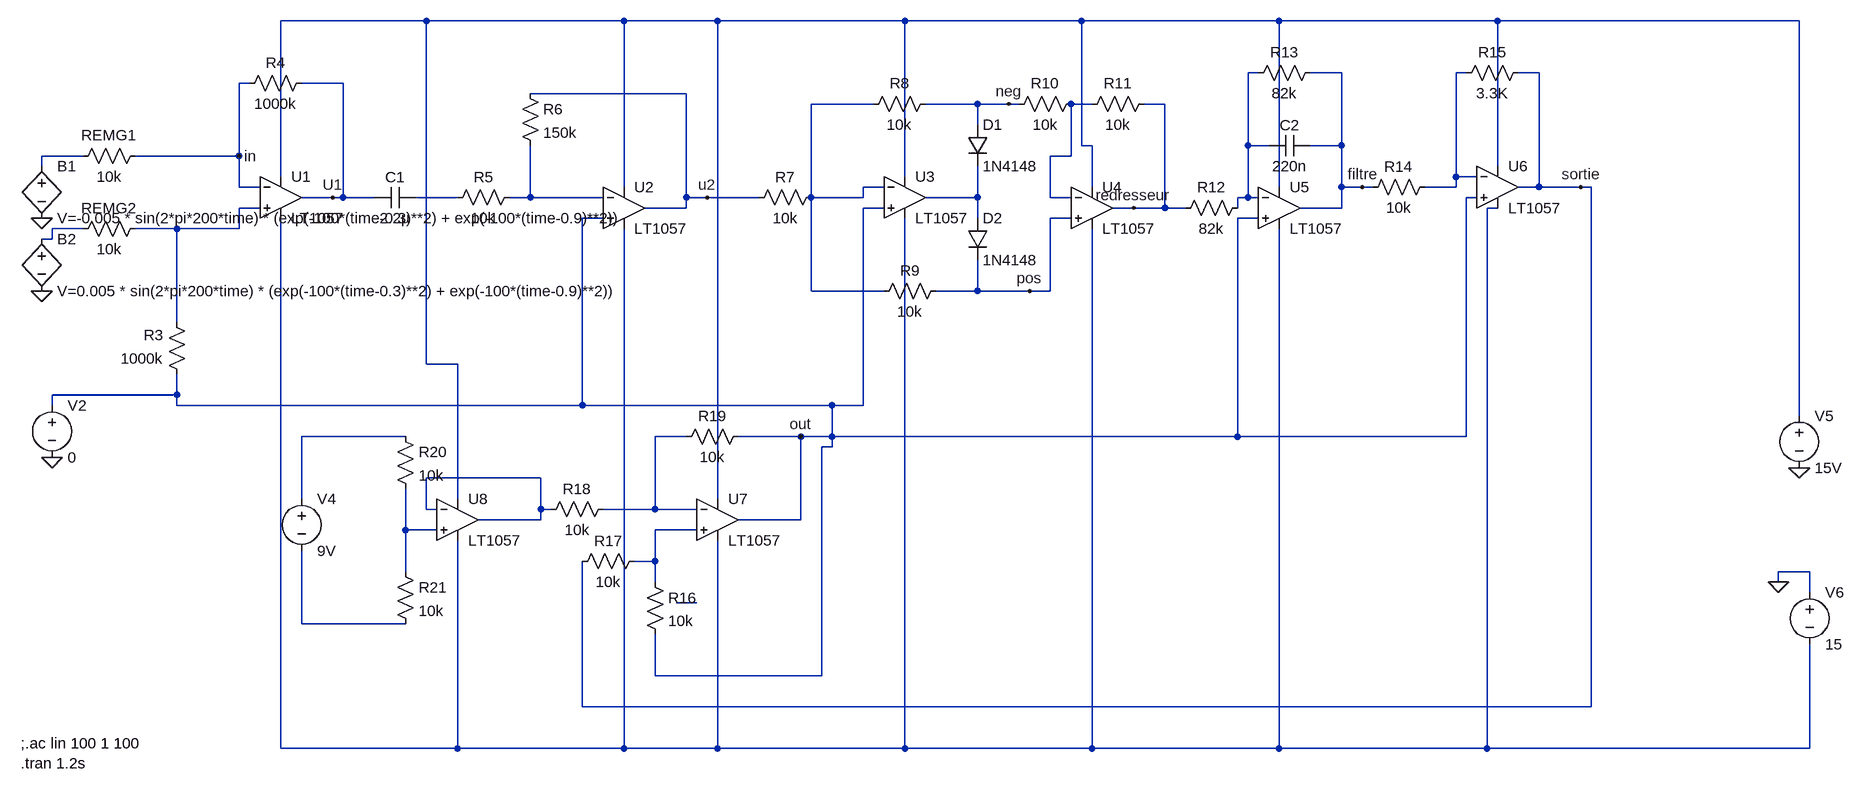
[diagram p0: schematic diagram_modified2.asc]
diagram_modified2.asc, the LTspice schematic file:
Version 4.1
SHEET 1 2724 680
WIRE 496 -1648 272 -1648
WIRE 800 -1648 496 -1648
WIRE 944 -1648 800 -1648
WIRE 1232 -1648 944 -1648
WIRE 1504 -1648 1232 -1648
WIRE 1808 -1648 1504 -1648
WIRE 2144 -1648 1808 -1648
WIRE 2608 -1648 2144 -1648
WIRE 1776 -1568 1760 -1568
WIRE 1904 -1568 1856 -1568
WIRE 2096 -1568 2080 -1568
WIRE 2208 -1568 2176 -1568
WIRE 224 -1552 208 -1552
WIRE 368 -1552 304 -1552
WIRE 896 -1536 656 -1536
WIRE 1184 -1520 1088 -1520
WIRE 1344 -1520 1264 -1520
WIRE 1392 -1520 1344 -1520
WIRE 1408 -1520 1392 -1520
WIRE 1520 -1520 1488 -1520
WIRE 1632 -1520 1600 -1520
WIRE 1344 -1488 1344 -1520
WIRE 1504 -1456 1504 -1648
WIRE 1520 -1456 1504 -1456
WIRE 1760 -1456 1760 -1568
WIRE 1792 -1456 1760 -1456
WIRE 1904 -1456 1904 -1568
WIRE 1904 -1456 1856 -1456
WIRE -32 -1440 -96 -1440
WIRE 208 -1440 208 -1552
WIRE 208 -1440 48 -1440
WIRE 1488 -1440 1488 -1520
WIRE 1488 -1440 1456 -1440
WIRE -96 -1424 -96 -1440
WIRE 2144 -1424 2144 -1648
WIRE 272 -1408 272 -1648
WIRE 1232 -1408 1232 -1648
WIRE 2080 -1408 2080 -1568
WIRE 2112 -1408 2080 -1408
WIRE 208 -1392 208 -1440
WIRE 240 -1392 208 -1392
WIRE 800 -1392 800 -1648
WIRE 1200 -1392 1168 -1392
WIRE 1520 -1392 1520 -1456
WIRE 1808 -1392 1808 -1648
WIRE 1904 -1392 1904 -1456
WIRE 1936 -1392 1904 -1392
WIRE 1952 -1392 1936 -1392
WIRE 2080 -1392 2080 -1408
WIRE 2080 -1392 2032 -1392
WIRE 2208 -1392 2208 -1568
WIRE 2208 -1392 2176 -1392
WIRE 2272 -1392 2208 -1392
WIRE 2288 -1392 2272 -1392
WIRE 352 -1376 304 -1376
WIRE 368 -1376 368 -1552
WIRE 368 -1376 352 -1376
WIRE 416 -1376 368 -1376
WIRE 544 -1376 480 -1376
WIRE 656 -1376 656 -1456
WIRE 656 -1376 624 -1376
WIRE 768 -1376 656 -1376
WIRE 896 -1376 896 -1536
WIRE 928 -1376 896 -1376
WIRE 1008 -1376 928 -1376
WIRE 1088 -1376 1088 -1520
WIRE 1168 -1376 1168 -1392
WIRE 1168 -1376 1088 -1376
WIRE 1344 -1376 1344 -1424
WIRE 1344 -1376 1264 -1376
WIRE 1456 -1376 1456 -1440
WIRE 1488 -1376 1456 -1376
WIRE 1760 -1376 1760 -1456
WIRE 1760 -1376 1744 -1376
WIRE 1776 -1376 1760 -1376
WIRE 2112 -1376 2096 -1376
WIRE 240 -1360 208 -1360
WIRE 896 -1360 896 -1376
WIRE 896 -1360 832 -1360
WIRE 1200 -1360 1168 -1360
WIRE 1584 -1360 1552 -1360
WIRE 1632 -1360 1632 -1520
WIRE 1632 -1360 1584 -1360
WIRE 1664 -1360 1632 -1360
WIRE 1744 -1360 1744 -1376
WIRE 1904 -1360 1904 -1392
WIRE 1904 -1360 1840 -1360
WIRE 2144 -1360 2128 -1360
WIRE 768 -1344 736 -1344
WIRE 1344 -1344 1344 -1376
WIRE 1488 -1344 1456 -1344
WIRE 1776 -1344 1744 -1344
WIRE -32 -1328 -80 -1328
WIRE 112 -1328 48 -1328
WIRE 208 -1328 208 -1360
WIRE 208 -1328 112 -1328
WIRE -80 -1312 -80 -1328
WIRE -80 -1312 -96 -1312
WIRE 1088 -1232 1088 -1376
WIRE 1200 -1232 1088 -1232
WIRE 1344 -1232 1344 -1280
WIRE 1344 -1232 1280 -1232
WIRE 1424 -1232 1344 -1232
WIRE 1456 -1232 1456 -1344
WIRE 1456 -1232 1424 -1232
WIRE 112 -1184 112 -1328
WIRE 496 -1120 496 -1648
WIRE 544 -1120 496 -1120
WIRE 112 -1072 112 -1104
WIRE 112 -1072 -80 -1072
WIRE -80 -1056 -80 -1072
WIRE 112 -1056 112 -1072
WIRE 736 -1056 736 -1344
WIRE 736 -1056 112 -1056
WIRE 1120 -1056 736 -1056
WIRE 1168 -1056 1168 -1360
WIRE 1168 -1056 1120 -1056
WIRE 2608 -1040 2608 -1648
WIRE 464 -1008 304 -1008
WIRE 896 -1008 848 -1008
WIRE 1072 -1008 976 -1008
WIRE 1120 -1008 1120 -1056
WIRE 1120 -1008 1072 -1008
WIRE 1744 -1008 1744 -1344
WIRE 1744 -1008 1120 -1008
WIRE 2096 -1008 2096 -1376
WIRE 2096 -1008 1744 -1008
WIRE 1120 -992 1120 -1008
WIRE 1120 -992 1104 -992
WIRE 672 -944 496 -944
WIRE 304 -912 304 -1008
WIRE 544 -912 544 -1120
WIRE 944 -912 944 -1648
WIRE 496 -896 496 -944
WIRE 512 -896 496 -896
WIRE 672 -896 672 -944
WIRE 688 -896 672 -896
WIRE 848 -896 848 -1008
WIRE 848 -896 768 -896
WIRE 912 -896 848 -896
WIRE 672 -880 672 -896
WIRE 672 -880 576 -880
WIRE 1072 -880 1072 -1008
WIRE 1072 -880 976 -880
WIRE 464 -864 464 -928
WIRE 512 -864 464 -864
WIRE 912 -864 848 -864
WIRE 848 -816 848 -864
WIRE 848 -816 816 -816
WIRE 464 -800 464 -864
WIRE 2624 -800 2576 -800
WIRE 848 -784 848 -816
WIRE 2576 -784 2576 -800
WIRE 2624 -768 2624 -800
WIRE 912 -752 880 -752
WIRE 304 -720 304 -832
WIRE 464 -720 304 -720
WIRE 848 -640 848 -704
WIRE 1104 -640 1104 -992
WIRE 1104 -640 848 -640
WIRE 736 -592 736 -816
WIRE 2288 -592 2288 -1392
WIRE 2288 -592 736 -592
WIRE 272 -528 272 -1344
WIRE 544 -528 544 -848
WIRE 544 -528 272 -528
WIRE 800 -528 800 -1328
WIRE 800 -528 544 -528
WIRE 944 -528 944 -848
WIRE 944 -528 800 -528
WIRE 1232 -528 1232 -1344
WIRE 1232 -528 944 -528
WIRE 1520 -528 1520 -1328
WIRE 1520 -528 1232 -528
WIRE 1808 -528 1808 -1328
WIRE 1808 -528 1520 -528
WIRE 2128 -528 2128 -1360
WIRE 2128 -528 1808 -528
WIRE 2624 -528 2624 -688
WIRE 2624 -528 2128 -528
FLAG -96 -1344 0
FLAG -96 -1232 0
FLAG -80 -976 0
FLAG 2608 -960 0
FLAG 2576 -784 0
FLAG 1072 -1008 out
FLAG 208 -1440 in
FLAG 352 -1376 U1
FLAG 1584 -1360 redresseur
FLAG 2272 -1392 sortie
FLAG 1424 -1232 pos
FLAG 1392 -1520 neg
FLAG 928 -1376 u2
FLAG 1936 -1392 filtre
DATAFLAG 1392 -1648 ""
DATAFLAG 1408 -528 ""
DATAFLAG 1984 -528 ""
DATAFLAG 1024 -1008 ""
DATAFLAG 1712 -528 ""
DATAFLAG 848 -656 ""
DATAFLAG 848 -848 ""
DATAFLAG 736 -704 ""
DATAFLAG 2304 -1216 ""
DATAFLAG 2288 -1296 ""
SYMBOL res 64 -1456 R90
WINDOW 0 0 56 VBottom 2
WINDOW 3 32 56 VTop 2
SYMATTR InstName REMG1
SYMATTR Value 10k
SYMBOL res 64 -1344 R90
WINDOW 0 0 56 VBottom 2
WINDOW 3 32 56 VTop 2
SYMATTR InstName REMG2
SYMATTR Value 10k
SYMBOL res 128 -1088 R180
WINDOW 0 36 76 Left 2
WINDOW 3 36 40 Left 2
SYMATTR InstName R3
SYMATTR Value 1000k
SYMBOL res 208 -1536 R270
WINDOW 0 32 56 VTop 2
WINDOW 3 0 56 VBottom 2
SYMATTR InstName R4
SYMATTR Value 1000k
SYMBOL OpAmps\\LT1057 272 -1440 R0
SYMATTR InstName U1
SYMBOL cap 480 -1392 R90
WINDOW 0 0 32 VBottom 2
WINDOW 3 32 32 VTop 2
SYMATTR InstName C1
SYMATTR Value 2.2µ
SYMBOL res 640 -1392 R90
WINDOW 0 0 56 VBottom 2
WINDOW 3 32 56 VTop 2
SYMATTR InstName R5
SYMATTR Value 10k
SYMBOL res 640 -1552 R0
SYMATTR InstName R6
SYMATTR Value 150k
SYMBOL OpAmps\\LT1057 800 -1424 R0
SYMATTR InstName U2
SYMBOL res 1104 -1392 R90
WINDOW 0 0 56 VBottom 2
WINDOW 3 32 56 VTop 2
SYMATTR InstName R7
SYMATTR Value 10k
SYMBOL res 1280 -1536 R90
WINDOW 0 0 56 VBottom 2
WINDOW 3 32 56 VTop 2
SYMATTR InstName R8
SYMATTR Value 10k
SYMBOL res 1296 -1248 R90
WINDOW 0 0 56 VBottom 2
WINDOW 3 32 56 VTop 2
SYMATTR InstName R9
SYMATTR Value 10k
SYMBOL OpAmps\\LT1057 1232 -1440 R0
SYMATTR InstName U3
SYMBOL diode 1328 -1488 R0
SYMATTR InstName D1
SYMATTR Value 1N4148
SYMBOL diode 1328 -1344 R0
SYMATTR InstName D2
SYMATTR Value 1N4148
SYMBOL OpAmps\\LT1057 1520 -1424 R0
SYMATTR InstName U4
SYMBOL res 1504 -1536 R90
WINDOW 0 0 56 VBottom 2
WINDOW 3 32 56 VTop 2
SYMATTR InstName R10
SYMATTR Value 10k
SYMBOL res 1616 -1536 R90
WINDOW 0 0 56 VBottom 2
WINDOW 3 32 56 VTop 2
SYMATTR InstName R11
SYMATTR Value 10k
SYMBOL OpAmps\\LT1057 1808 -1424 R0
SYMATTR InstName U5
SYMBOL res 1760 -1376 R90
WINDOW 0 0 56 VBottom 2
WINDOW 3 32 56 VTop 2
SYMATTR InstName R12
SYMATTR Value 82k
SYMBOL res 1872 -1584 R90
WINDOW 0 0 56 VBottom 2
WINDOW 3 32 56 VTop 2
SYMATTR InstName R13
SYMATTR Value 82k
SYMBOL res 2048 -1408 R90
WINDOW 0 0 56 VBottom 2
WINDOW 3 32 56 VTop 2
SYMATTR InstName R14
SYMATTR Value 10k
SYMBOL cap 1856 -1472 R90
WINDOW 0 0 32 VBottom 2
WINDOW 3 32 32 VTop 2
SYMATTR InstName C2
SYMATTR Value 220n
SYMBOL res 2192 -1584 R90
WINDOW 0 0 56 VBottom 2
WINDOW 3 32 56 VTop 2
SYMATTR InstName R15
SYMATTR Value 3.3K
SYMBOL OpAmps\\LT1057 2144 -1456 R0
SYMATTR InstName U6
SYMBOL OpAmps\\LT1057 944 -944 R0
SYMATTR InstName U7
SYMBOL OpAmps\\LT1057 544 -944 R0
SYMATTR InstName U8
SYMBOL res 832 -800 R0
SYMATTR InstName R16
SYMATTR Value 10k
SYMBOL res 832 -832 R90
WINDOW 0 0 56 VBottom 2
WINDOW 3 32 56 VTop 2
SYMATTR InstName R17
SYMATTR Value 10k
SYMBOL res 784 -912 R90
WINDOW 0 0 56 VBottom 2
WINDOW 3 32 56 VTop 2
SYMATTR InstName R18
SYMATTR Value 10k
SYMBOL res 992 -1024 R90
WINDOW 0 0 56 VBottom 2
WINDOW 3 32 56 VTop 2
SYMATTR InstName R19
SYMATTR Value 10k
SYMBOL res 448 -1024 R0
SYMATTR InstName R20
SYMATTR Value 10k
SYMBOL res 448 -816 R0
SYMATTR InstName R21
SYMATTR Value 10k
SYMBOL voltage -80 -1072 R0
WINDOW 123 0 0 Left 0
WINDOW 39 0 0 Left 0
SYMATTR InstName V2
SYMATTR Value 0
SYMBOL voltage 304 -928 R0
SYMATTR InstName V4
SYMATTR Value 9V
SYMBOL voltage 2608 -1056 R0
WINDOW 123 0 0 Left 0
WINDOW 39 0 0 Left 0
SYMATTR InstName V5
SYMATTR Value 15V
SYMBOL voltage 2624 -784 R0
WINDOW 123 0 0 Left 0
WINDOW 39 0 0 Left 0
SYMATTR InstName V6
SYMATTR Value 15
SYMBOL bv -96 -1440 R0
SYMATTR InstName B1
SYMATTR Value V=-0.005 * sin(2*pi*200*time) * (exp(-100*(time-0.3)**2) + exp(-100*(time-0.9)**2))
SYMBOL bv -96 -1328 R0
SYMATTR InstName B2
SYMATTR Value V=0.005 * sin(2*pi*200*time) * (exp(-100*(time-0.3)**2) + exp(-100*(time-0.9)**2))
TEXT -128 -536 Left 2 !;.ac lin 100 1 100\n.tran 1.2s

The netlist it stands for:
* diagram_modified2.asc
REMG1 in N006 10k
REMG2 N010 N012 10k
R3 out N010 1000k
R4 in U1 1000k
X§U1 N010 in N001 N011 U1 LT1057  ; pins In+ In- V+ V- OUT
C1 N007 U1 2.2µ
R5 N008 N007 10k
R6 u2 N008 150k
X§U2 out N008 N001 N011 u2 LT1057  ; pins In+ In- V+ V- OUT
R7 N004 u2 10k
R8 neg N004 10k
R9 pos N004 10k
X§U3 out N004 N001 N011 N009 LT1057  ; pins In+ In- V+ V- OUT
D1 neg N009 1N4148
D2 N009 pos 1N4148
X§U4 pos N005 N001 N011 redresseur LT1057  ; pins In+ In- V+ V- OUT
R10 N005 neg 10k
R11 redresseur N005 10k
X§U5 out N002 N001 N011 filtre LT1057  ; pins In+ In- V+ V- OUT
R12 N002 redresseur 82k
R13 filtre N002 82k
R14 N003 filtre 10k
C2 filtre N002 220n
R15 sortie N003 3.3K
X§U6 out N003 N001 N011 sortie LT1057  ; pins In+ In- V+ V- OUT
X§U7 N017 N014 N001 N011 out LT1057  ; pins In+ In- V+ V- OUT
X§U8 N016 N015 N001 N011 N015 LT1057  ; pins In+ In- V+ V- OUT
R16 N017 out 10k
R17 N017 sortie 10k
R18 N014 N015 10k
R19 out N014 10k
R20 N013 N016 10k
R21 N016 N019 10k
V2 out 0 0
V4 N013 N019 9V
V5 N001 0 15V
V6 0 N011 15
B1 N006 0 V=-0.005 * sin(2*pi*200*time) * (exp(-100*(time-0.3)**2) + exp(-100*(time-0.9)**2))
B2 N012 0 V=0.005 * sin(2*pi*200*time) * (exp(-100*(time-0.3)**2) + exp(-100*(time-0.9)**2))
.model D D
.lib standard.dio
;.ac lin 100 1 100
.tran 1.2s
.lib LTC.lib
.backanno
.end